# Altium schematic sheet ISO_PWR_UCC12040DVER.SchDoc
size A4; SheetNumber: 5; SheetTotal: 7
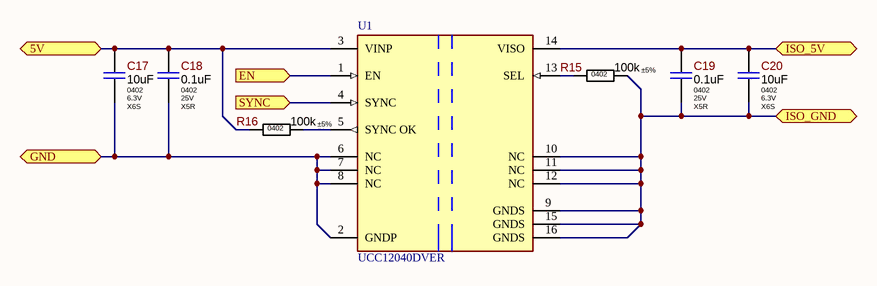
[diagram p0: ISO_PWR_UCC12040DVER.SchDoc]

## Parts
C17  Package: 0402  Voltage: 6.3V  Dielectric Type: X6S  [C_CERAMIC_0402_MED]  (hidden comment: 10uF)
C18  Package: 0402  Voltage: 25V  Dielectric Type: X5R  [C_CERAMIC_0402_MED]  (hidden comment: 0.1uF)
C19  Package: 0402  Voltage: 25V  Dielectric Type: X5R  [C_CERAMIC_0402_MED]  (hidden comment: 0.1uF)
C20  Package: 0402  Voltage: 6.3V  Dielectric Type: X6S  [C_CERAMIC_0402_MED]  (hidden comment: 10uF)
R15  Tolerance: ±5%  Package: 0402  [R_ANY_CHIP_0402_HI]  (hidden comment: 100k)  (no BOM)
R16  Tolerance: ±5%  Package: 0402  [R_ANY_CHIP_0402_HI]  (hidden comment: 100k)  (no BOM)
U1  UCC12040DVER  [FP-DVE0016A-MFG]

## Ports
5V (bidir, see DefaultProject[6C]), EN (in, see DefaultProject[6C]), GND (bidir, see DefaultProject[6C], DC-DC_5V0_To_3V3[2C], DC-DC_24V_To_5V0[1C], MCU_STM32L010K4T6[3B], MCU_STM32L010K4T6[4B]), ISO_5V (bidir, see DefaultProject[5C]), ISO_GND (bidir, see DefaultProject[5C]), SYNC (in, see DefaultProject[6C])

## Nets
5V: C17.1 C18.1 R16.1 U1.3(VINP) ; port 5V
EN: U1.1(EN) ; port EN
GND: C17.2 C18.2 U1.2(GNDP) U1.6(NC) U1.7(NC) U1.8(NC) ; port GND
ISO_5V: C19.1 C20.1 U1.14(VISO) ; port ISO_5V
ISO_GND: C19.2 C20.2 R15.2 U1.9(GNDS) U1.10(NC) U1.11(NC) U1.12(NC) U1.15(GNDS) U1.16(GNDS) ; port ISO_GND
SYNC: U1.4(SYNC) ; port SYNC
NetR15_1: R15.1 U1.13(SEL)
NetR16_2: R16.2 U1.5(SYNC_OK)

## Library data of the parts
C17 C20 = Capacitor-NonPolar: 10uF 6.3V X6S ±20% 0402 Ceramic Capacitor RoHS; Part Number: GRM155C80J106ME11D; Manufacturer: Murata Electronics; Component Status: Released; Standard Lead Time: 15 Weeks; Replacement: NONE; Value: 10uF; Part Type: Ceramic / X6S / 0402; Component Type: SMD; Temperature Range: -55°C ~ 105°C; Tolerance: ±20%; ComponentLink1URL: https://search.murata.co.jp/Ceramy/image/img/A01X/G101/ENG/GRM155C80J106ME11-01.pdf; Supplier 1: Digi-Key; Supplier Part Number 1: 490-13233-1-ND; Price: 0.01104; ComponentLink1Description: Datasheet
C18 C19 = Capacitor-NonPolar: 100nF 25V X5R ±10% 0402 Ceramic Capacitor RoHS; Part Number: CL05A104KA5NNNC; Manufacturer: Samsung Electro-Mechanics; Standard Lead Time: 38 Weeks; Component Status: Released; Replacement: NONE; Value: 0.1uF; Part Type: Ceramic / X5R / 0402; Component Type: SMD; Temperature Range: -55°C ~ 85°C; Tolerance: ±10%; ComponentLink1URL: https://eu.mouser.com/datasheet/2/585/MLCC-1837944.pdf; ComponentLink1Description: Datasheet; Price: 0.0013; Supplier 1: Mouser; Supplier Part Number 1: 187-CL05A104KA5NNNC
R15 R16 = Resistor: 100 kOhms ±5% 1/16W 0402 Thick Film Resistor; Part Number: RC0402JR-07100KL; Manufacturer: Yageo; Power Rating: 0.062W; Voltage: 50V; Component Status: Released; Temperature Stability: ±100ppm/°C; Replacement: NONE; Value: 100k; Component Type: SMD; Part Type: Thick Film; Temperature Range: -55°C ~ 155°C; ComponentLink1URL: https://eu.mouser.com/datasheet/2/447/PYu_RC_Group_51_RoHS_L_10-1664068.pdf; Supplier 1: Digi-Key; Supplier Part Number 1: 311-100KJRTR-ND; Price: 0.00054; ComponentLink1Description: Datasheet
U1 = CMP-04910-000064-1: DC DC CONVERTER 5V 500mW; Number of Outputs: 1; Input Voltage - Min: 4.5V; Input Voltage - Max: 5.5V; Isolation Voltage: 3 kV; Unit Weight: 5 g; Part Number: UCC12040DVER; Supplier 1: Mouser; Supplier Part Number 1: 595-UCC12040DVER; Mounting Style: SMD/SMT; ComponentLink1Description: Datasheet; ComponentLink1URL: https://www.ti.com/lit/ds/symlink/ucc12040.pdf?ts=1755529908774&ref_url=https%253A%252F%252Fwww.ti.com%252Fproduct%252FUCC12040; Output Power: 500 mW; Input Voltage, Nominal: 5V; Package/Case: SOIC-16; Product Type: Isolated DC-DC Converters; Subcategory: DC-DC Converters